# Altium schematic sheet MB1-SD_CARD.SchDoc: uSD card
size A; Author: Nguyen Van Hien; DrawnBy: MBoard team; DocumentNumber: 6; Revision: 1.1; SheetNumber: 6; SheetTotal: 7; DocumentName: SD_CARD
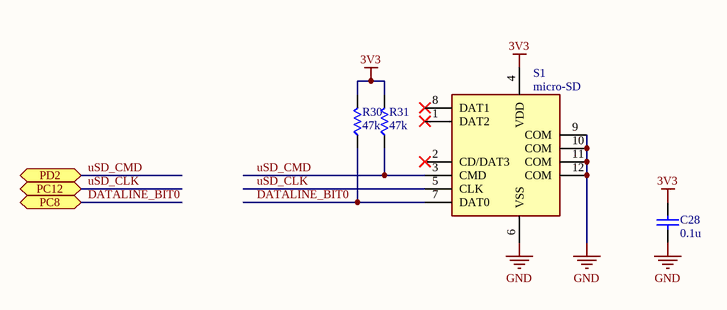
[diagram p0: MB1-SD_CARD.SchDoc]

## Parts
C28  value 0.1u  [SM_0805_C_CERAMIC]  (hidden comment: CAP_Ceramic)
R30  value 47k  [SM_0805_R]
R31  value 47k  [SM_0805_R]
S1  micro-SD  [micro-SD]

## Ports
PC8 (bidir), PC12 (bidir), PD2 (bidir)

## Nets
3V3: C28.2 R30.2 R31.2 S1.4(VDD)
GND: C28.1 S1.6(VSS) S1.9(COM) S1.10(COM) S1.11(COM) S1.12(COM)
DATALINE_BIT0: R30.1 S1.7(DAT0) ; port PC8
uSD_CLK: S1.5(CLK) ; port PC12
uSD_CMD: R31.1 S1.3(CMD) ; port PD2

Not connected (* = marked no-connect by the designer): S1 1(DAT2)* 2(CD/DAT3)* 8(DAT1)*

## Library data of the parts
C28 = C_Ceramic: Non-polarity ceramic capacitor; Published: 8-Jun-2000; LatestRevisionDate: 17-Jul-2002; LatestRevisionNote: Re-released for DXP Platform.; PackageReference: RAD-0.3; Publisher: Altium Limited; PackageDescription: Radial Cap, Thru-Hole; 2 Leads; 0.3 in Pin Spacing
R30 R31 = R: Resistor; Published: 8-Jun-2000; LatestRevisionDate: 29-May-2009; LatestRevisionNote: IPC-7351 Footprint Added.; PackageReference: J1-0603; Publisher: Altium Limited; PackageDescription: Chip Resistor